# Altium schematic sheet PIC18F57Q84_Curiosity_Nano_TopLevel.SchDoc
size A3; SheetTitle: Top Level; CompanyName: Microchip Technology Inc.; Organization: Microchip Technology; Address1: 2355 West Chandler Blvd.; Address2: Chandler, AZ  85224; Address4: USA; SheetNumber: 1; SheetTotal: 4; Time: Time
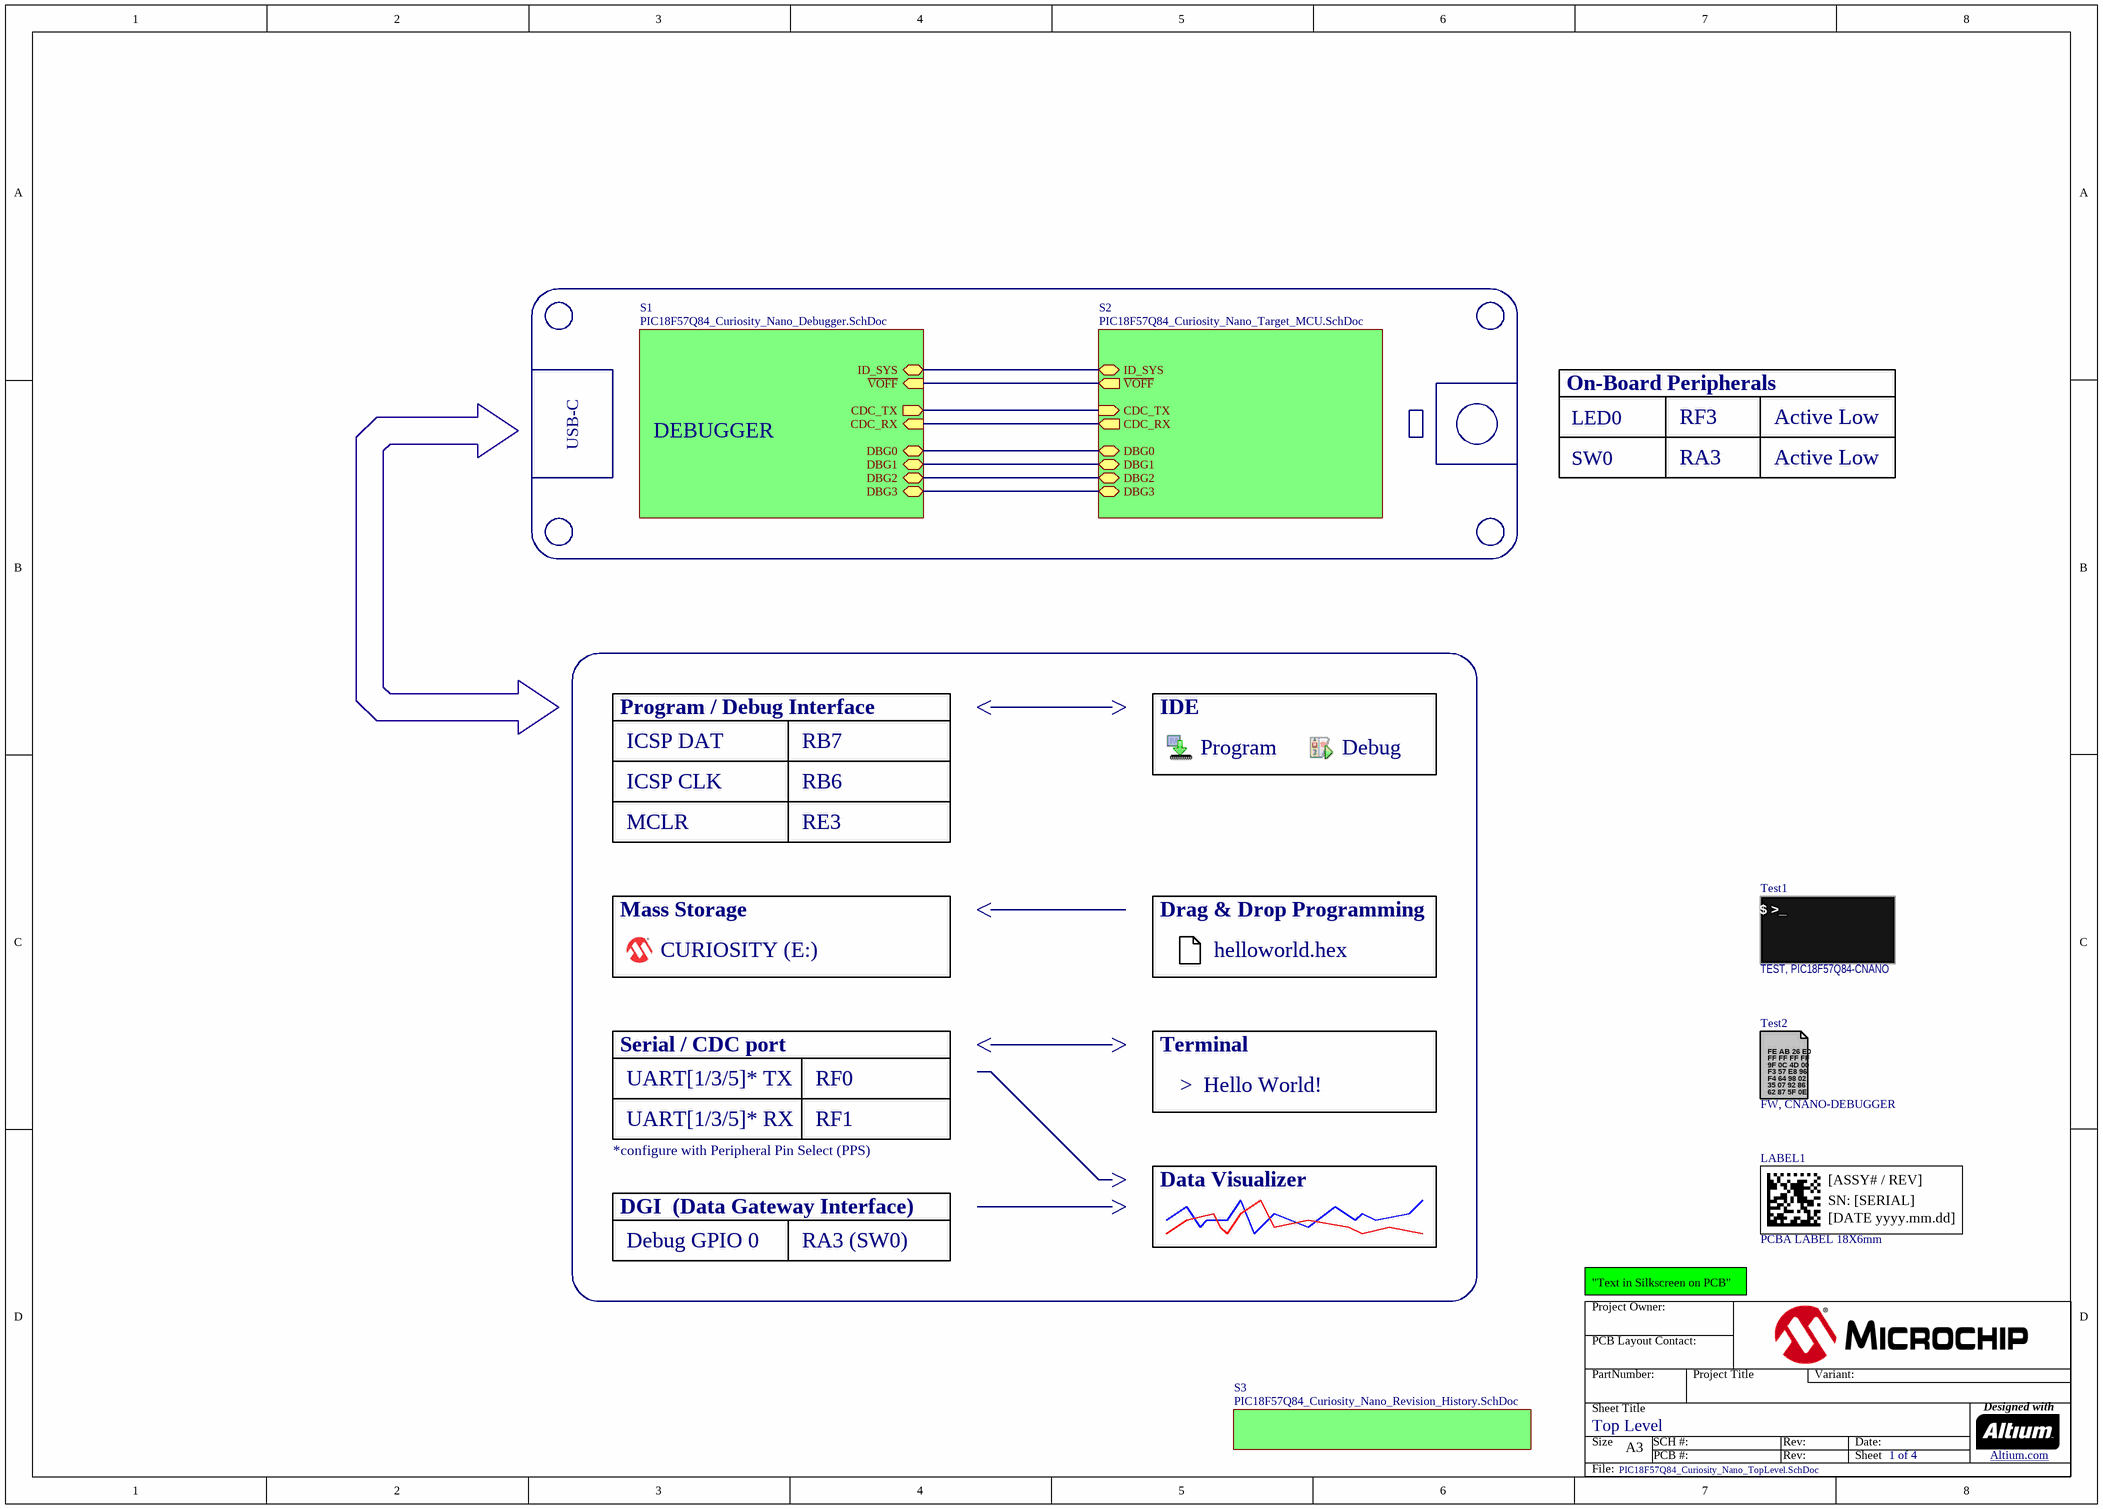
[diagram p0: PIC18F57Q84_Curiosity_Nano_TopLevel.SchDoc]

## Parts
LABEL1  value PCBA LABEL 18X6mm  [08-10015]  (hidden comment: 08-10015)
Test1  Description_: TEST, PIC18F57Q84-CNANO  (hidden comment: Mechanical)  (mechanical)
Test2  Description_: FW, CNANO-DEBUGGER  (hidden comment: Mechanical)  (mechanical)

## Sub-sheets
S1 = PIC18F57Q84_Curiosity_Nano_Debugger.SchDoc: DBG2 (bidir), DBG1 (bidir), DBG3 (bidir), DBG0 (bidir), ~{VOFF} (in), ID_SYS (bidir), CDC_RX (in), CDC_TX (out)
S2 = PIC18F57Q84_Curiosity_Nano_Target_MCU.SchDoc: DBG0 (bidir), DBG1 (bidir), DBG3 (bidir), DBG2 (bidir), ~{VOFF} (out), ID_SYS (bidir), CDC_RX (out), CDC_TX (in)
S3 = PIC18F57Q84_Curiosity_Nano_Revision_History.SchDoc: no entries

## Nets
(unnamed): sheet S2/DBG0, sheet S1/DBG0
(unnamed): sheet S2/DBG1, sheet S1/DBG1
(unnamed): sheet S2/DBG3, sheet S1/DBG3
(unnamed): sheet S2/DBG2, sheet S1/DBG2
(unnamed): sheet S2/~{VOFF}, sheet S1/~{VOFF}
(unnamed): sheet S2/ID_SYS, sheet S1/ID_SYS
(unnamed): sheet S2/CDC_RX, sheet S1/CDC_RX
(unnamed): sheet S2/CDC_TX, sheet S1/CDC_TX

## Notes on the sheet
- USB-C
- DEBUGGER
- On-Board Peripherals
- LED0
- RF3
- Active Low
- SW0
- RA3
- Program / Debug Interface
- IDE
- ICSP DAT
- RB7
- Program
- Debug
- ICSP CLK
- MCLR
- RB6
- RE3
- Mass Storage
- Drag & Drop Programming
- CURIOSITY (E:)
- helloworld.hex
- Serial / CDC port
- Terminal
- UART[1/3/5]* TX
- UART[1/3/5]* RX
- RF1
- RF0
- >  Hello World!
- *configure with Peripheral Pin Select (PPS)
- Data Visualizer
- DGI  (Data Gateway Interface)
- Debug GPIO 0
- RA3 (SW0)
- "Text in Silkscreen on PCB"
- Project Owner:
- PCB Layout Contact:
- PartNumber:
- Project Title
- Variant:
- Sheet Title
- Size
- A3
- SCH #:
- PCB #:
- Rev:
- Date:
- Sheet
- Designed with
- Altium.com <http://go.altium.com/MicrochipLandingPage_Evaluation.html>
- File:
- (in symbol 08-10015) [ASSY# / REV]; SN: [SERIAL]; [DATE yyyy.mm.dd]
- (in symbol 13-00018) FE AB 26 E0; FF FF FF FF; 9F 0C 4D 00; F3 57 E8 96; F4 64 98 02; 35 07 92 86; 62 87 5F 0E
- (in symbol 13-01146) $ >_

## Library data of the parts
LABEL1 = 08-10015: Manufacturer 1: ACT Logimark AS; Manufacturer Part Number 1: 505462; Description_: LABEL PCBA 18x6mm Datamatrix Assy# / Rev / Serial / Date; Populated: MECH; Revision: 4; Symbol: 08-10015; Category: MCHP-Manufacturing; Type: PCBA Label; Manufacturer 2: Sunrise Paper (M) Sdn Bhd; Manufacturer Part Number 2: 037268-5; Manufacturer 3: Raynen; Manufacturer Part Number 3: 10010407; Supplier 1: ACT Logimark AS; Supplier Part Number 1: 505462; Supplier 2: Microchip Technology; Supplier Part Number 2: 01000-004967; Supplier 3: Raynen; Supplier Part Number 3: 10010407
Test1 = 13-01146: Populated: Yes; Revision: 5; Type: Test Procedure Automated; Category: MCHP-Manufacturing
Test2 = 13-00018: Populated: Yes; Value: Debugger Firmware; Revision: 9; Type: Test Procedure Firmware; Category: MCHP-Manufacturing